# EAGLE design vertical_driver (EAGLE 8.5.2)
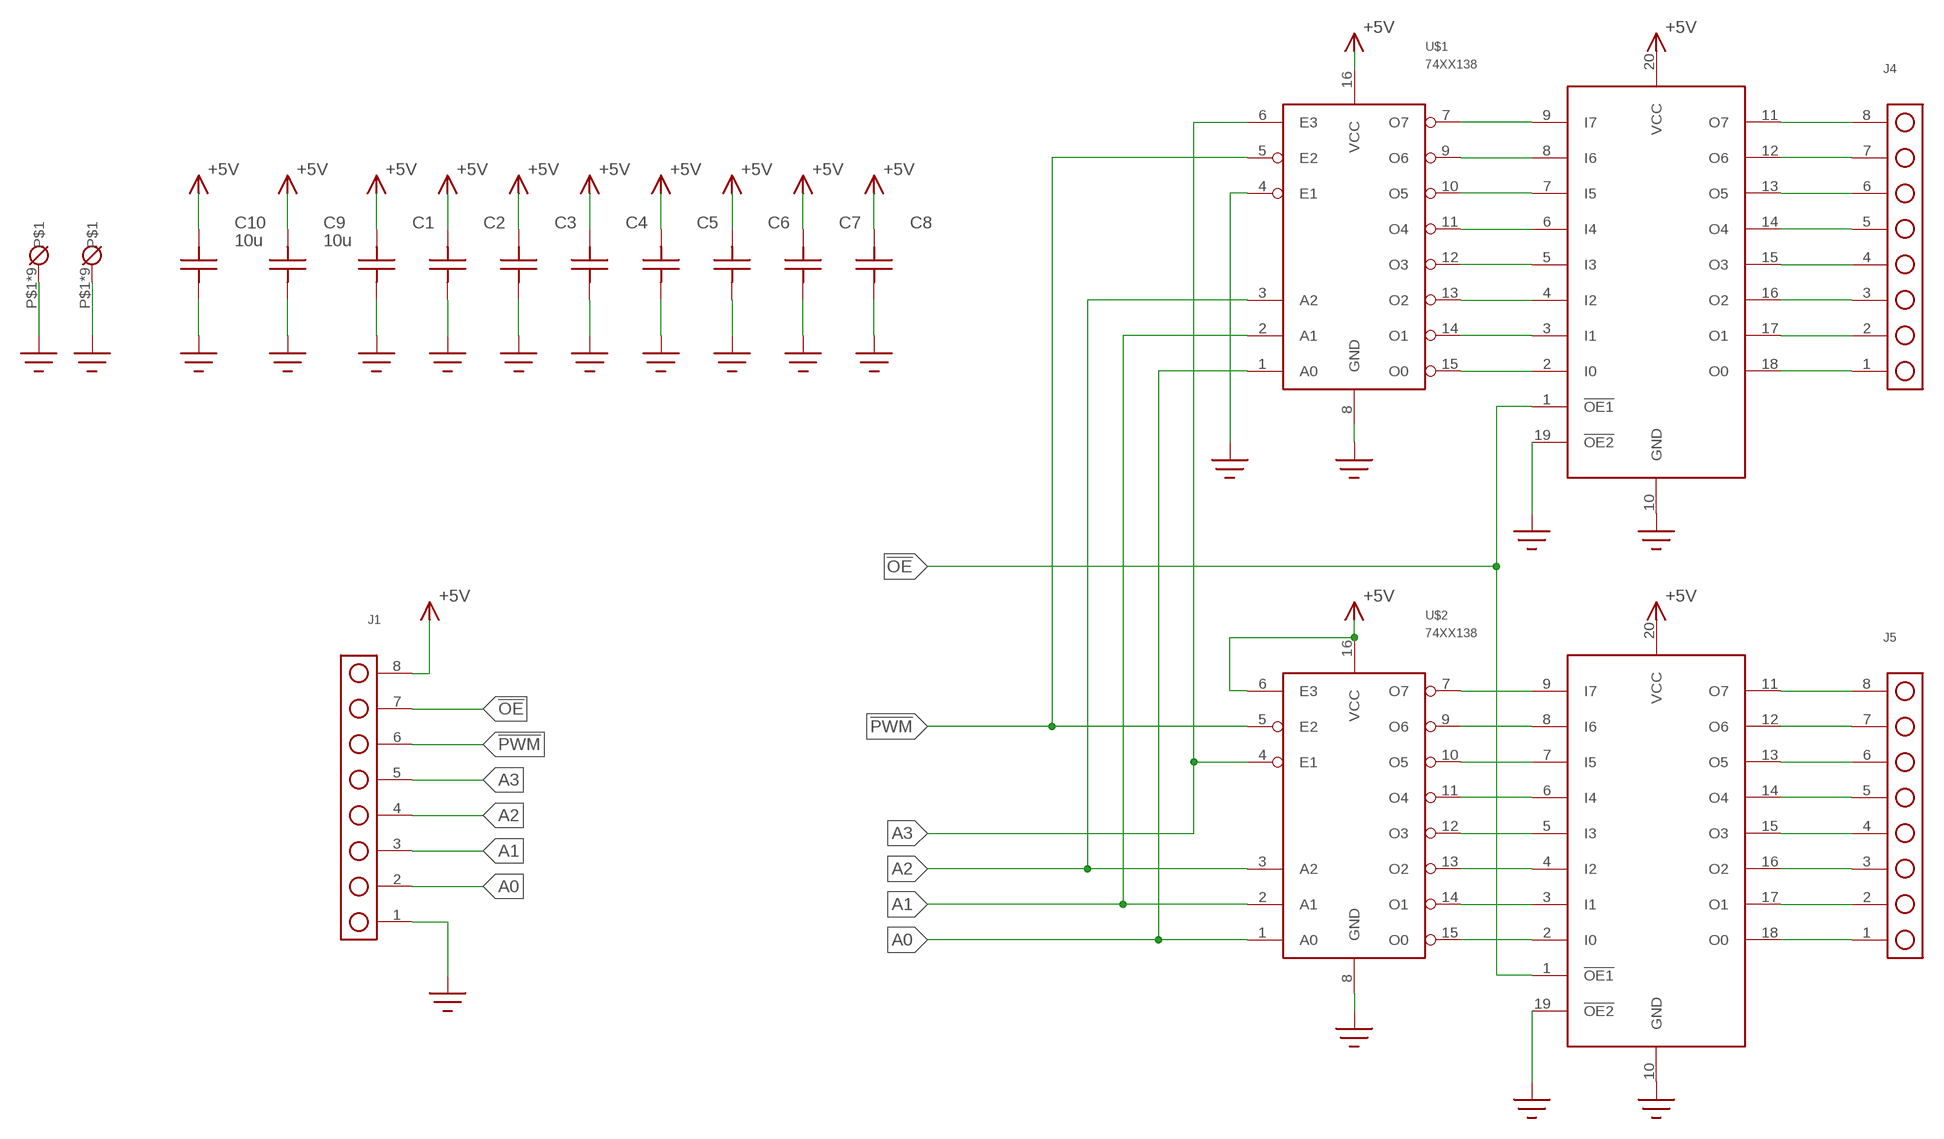
[diagram p0: schematic, sheet 1]

## Parts
C1  C0805  [0805]
C2  C0805  [0805]
C3  C0805  [0805]
C4  C0805  [0805]
C5  C0805  [0805]
C6  C0805  [0805]
C7  C0805  [0805]
C8  C0805  [0805]
C9  10u  C1206  [1206]
C10  10u  C1206  [1206]
J1  HEADER_8P  [HEADER_8P]
J4  HEADER_8P  [HEADER_8P]
J5  HEADER_8P  [HEADER_8P]
U$1  74XX138  [SOIC-16]
U$2  74XX138  [SOIC-16]
U$8  74XX540  [SOIC-20W]
U$9  74XX540  [SOIC-20W]
U$34  MOUNTING_HOLE  [MOUNTING_HOLE_#4]
U$35  MOUNTING_HOLE  [MOUNTING_HOLE_#4]

## Nets
!OE!: J1.7 U$8.1(!OE1!) U$9.1(!OE1!)
!PWM!: J1.6 U$1.5(E2) U$2.5(E2)
+5V: C1.P$2 C2.P$2 C3.P$2 C4.P$2 C5.P$2 C6.P$2 C7.P$2 C8.P$2 C9.P$2 C10.P$2 J1.8 U$1.16(VCC) U$2.6(E3) U$2.16(VCC) U$8.20(VCC) U$9.20(VCC)
A0: J1.2 U$1.1(A0) U$2.1(A0)
A1: J1.3 U$1.2(A1) U$2.2(A1)
A2: J1.4 U$1.3(A2) U$2.3(A2)
A3: J1.5 U$1.6(E3) U$2.4(E1)
GND: C1.P$1 C2.P$1 C3.P$1 C4.P$1 C5.P$1 C6.P$1 C7.P$1 C8.P$1 C9.P$1 C10.P$1 J1.1 U$1.4(E1) U$1.8(GND) U$2.8(GND) U$8.10(GND) U$8.19(!OE2!) U$9.10(GND) U$9.19(!OE2!) U$34.P$1 U$34.P$2 U$34.P$3 U$34.P$4 U$34.P$5 U$34.P$6 U$34.P$7 U$34.P$8 U$34.P$9 U$35.P$1 U$35.P$2 U$35.P$3 U$35.P$4 U$35.P$5 U$35.P$6 U$35.P$7 U$35.P$8 U$35.P$9
N$1: U$1.7(O7) U$8.9(I7)
N$2: U$1.9(O6) U$8.8(I6)
N$3: U$1.10(O5) U$8.7(I5)
N$4: U$1.11(O4) U$8.6(I4)
N$5: U$1.12(O3) U$8.5(I3)
N$6: U$1.13(O2) U$8.4(I2)
N$7: U$1.14(O1) U$8.3(I1)
N$8: U$1.15(O0) U$8.2(I0)
N$9: J4.8 U$8.11(O7)
N$10: J4.7 U$8.12(O6)
N$11: J4.6 U$8.13(O5)
N$12: J4.5 U$8.14(O4)
N$13: J4.4 U$8.15(O3)
N$14: J4.3 U$8.16(O2)
N$15: J4.2 U$8.17(O1)
N$16: J4.1 U$8.18(O0)
N$17: U$2.7(O7) U$9.9(I7)
N$18: U$2.9(O6) U$9.8(I6)
N$19: U$2.10(O5) U$9.7(I5)
N$20: U$2.11(O4) U$9.6(I4)
N$21: U$2.12(O3) U$9.5(I3)
N$22: U$2.13(O2) U$9.4(I2)
N$23: U$2.14(O1) U$9.3(I1)
N$24: U$2.15(O0) U$9.2(I0)
N$25: J5.8 U$9.11(O7)
N$26: J5.7 U$9.12(O6)
N$27: J5.6 U$9.13(O5)
N$28: J5.5 U$9.14(O4)
N$29: J5.4 U$9.15(O3)
N$30: J5.3 U$9.16(O2)
N$31: J5.2 U$9.17(O1)
N$32: J5.1 U$9.18(O0)

## Library data of the parts
C1-C10 = led_oscilloscope:C
J1 J4 J5 = led_oscilloscope:HEADER_8P
U$1 U$2 = led_oscilloscope:74XX138
U$8 U$9 = led_oscilloscope:74XX540
U$34 U$35 = led_oscilloscope:MOUNTING_HOLE

## Board
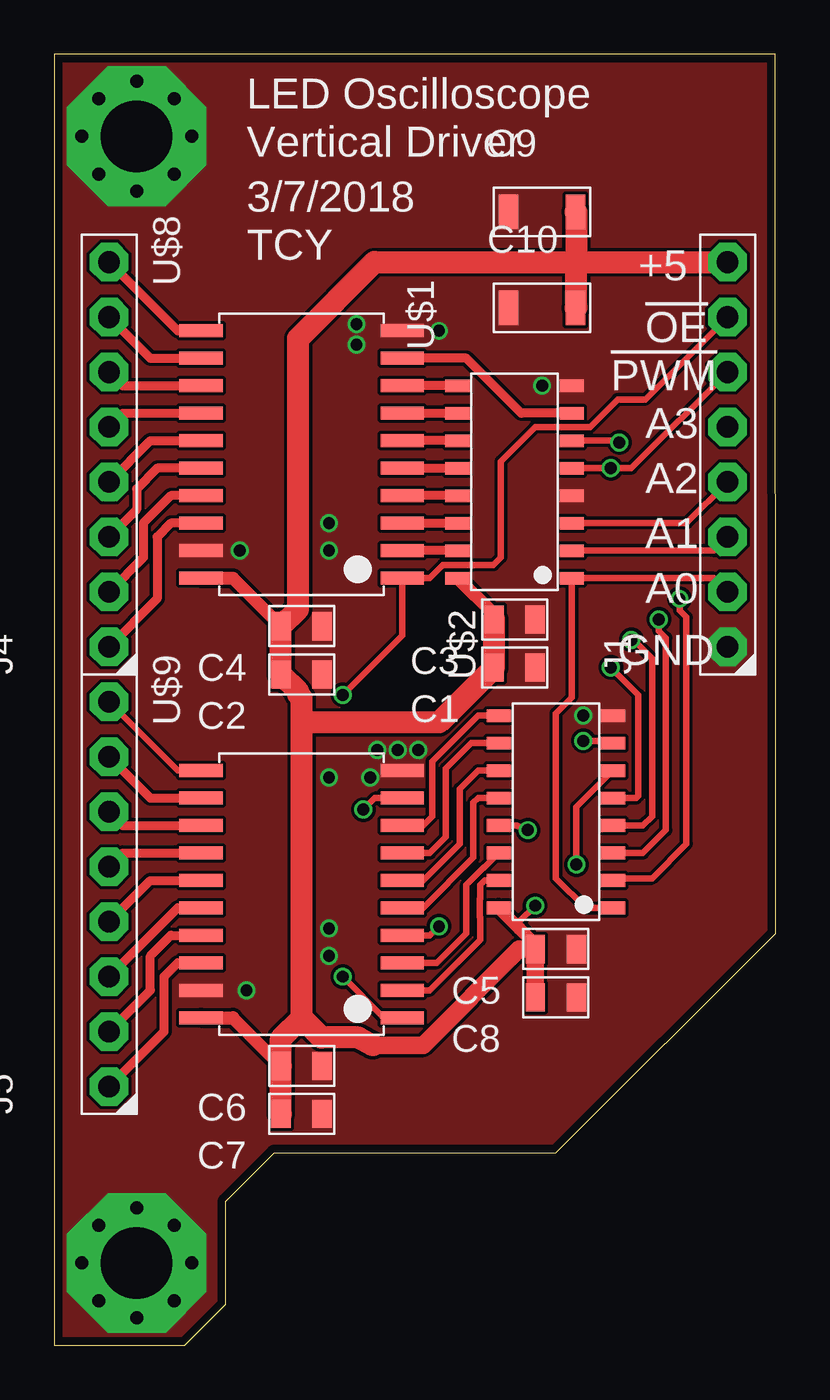
[diagram p1: board, top side]
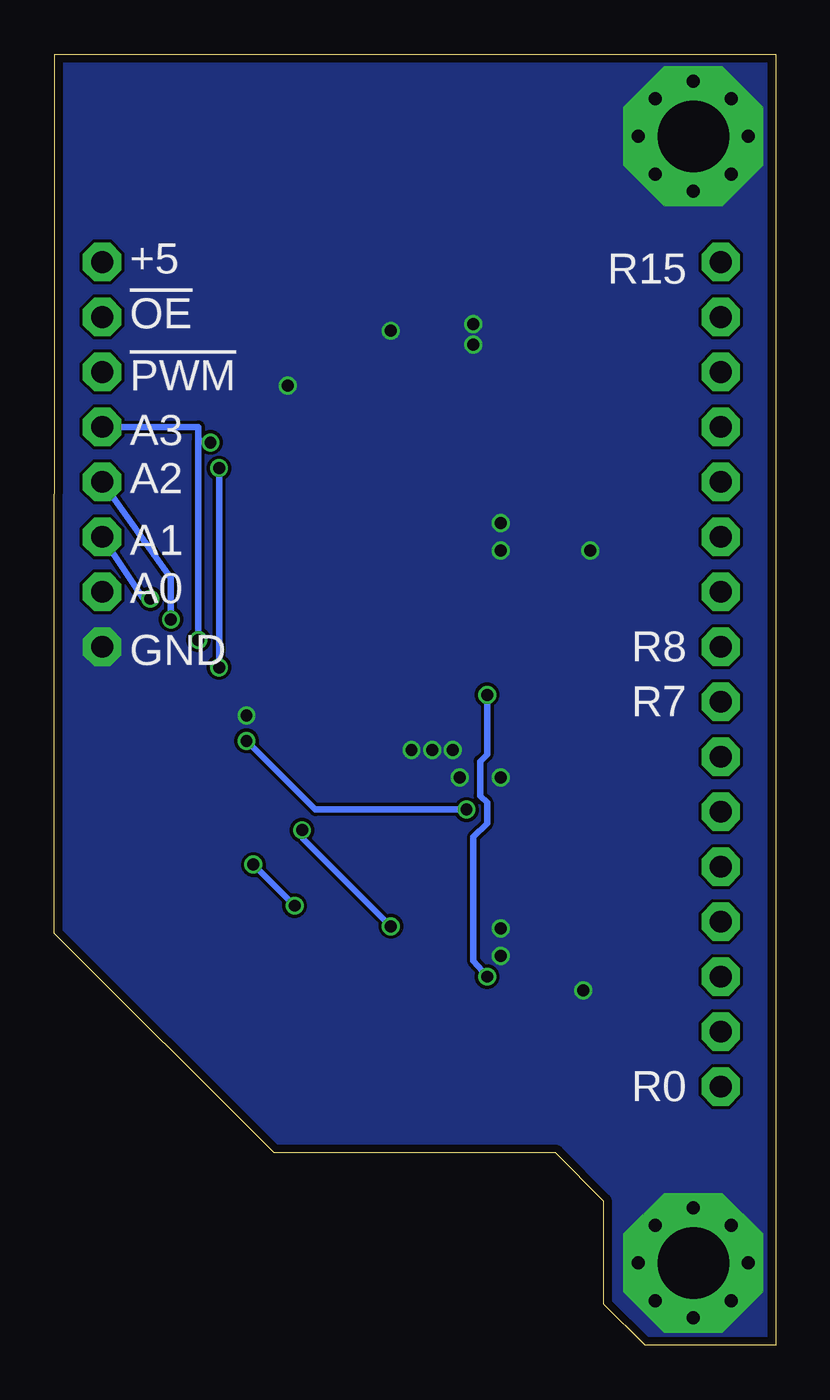
[diagram p2: board, bottom side, seen from below]

Size 33.34 x 59.68 mm. Coordinates in mm from the lower left corner, seen from the top.
Outline: 0,0 6.03,0 7.94,1.91 7.94,6.67 10.16,8.89 23.18,8.89 33.34,19.05 33.32,59.68 0,59.68 0,0
Copper layers (1*16): Top 0.035559375mm / dielectric 1.6mm / Bottom 0.035559375mm
Design rules "oshpark-2layer": minimum track width 6mil, minimum drill 10mil, track to track 6mil, track to pad 6mil, pad to pad 6mil, via to via 6mil, smd to smd 6mil, copper to edge 15mil, drill to drill 6mil, minimum pad ring 5mil, minimum via ring 5mil, stop-mask expansion 2.5mil, vias tented up to drill 0mil, thermal gap 10mil

### Footprints (pad centres in the part's own frame; a part is rotated, then mirrored left to right if it is on the bottom)
0805 = smd 0.9 x 1.3: P$1 -0.95,0; P$2 0.95,0
1206 = smd 0.9 x 1.6: P$1 -1.55,0; P$2 1.55,0
HEADER_8P = drill 1 pad 1.778 octagon: 1 -8.89,0; 2 -6.35,0; 3 -3.81,0; 4 -1.27,0; 5 1.27,0; 6 3.81,0; 7 6.35,0; 8 8.89,0
SOIC-16 = smd 0.58 x 1.12: 1 -4.445,-2.64; 2 -3.175,-2.64; 3 -1.905,-2.64; 4 -0.635,-2.64; 5 0.635,-2.64; 6 1.905,-2.64; 7 3.175,-2.64; 8 4.445,-2.64; 9 4.445,2.64; 10 3.175,2.64; 11 1.905,2.64; 12 0.635,2.64; 13 -0.635,2.64; 14 -1.905,2.64; 15 -3.175,2.64; 16 -4.445,2.64
SOIC-20W = smd 0.6 x 2: 1 -5.715,-4.65; 2 -4.445,-4.65; 3 -3.175,-4.65; 4 -1.905,-4.65; 5 -0.635,-4.65; 6 0.635,-4.65; 7 1.905,-4.65; 8 3.175,-4.65; 9 4.445,-4.65; 10 5.715,-4.65; 11 5.715,4.65; 12 4.445,4.65; 13 3.175,4.65; 14 1.905,4.65; 15 0.635,4.65; 16 -0.635,4.65; 17 -1.905,4.65; 18 -3.175,4.65; 19 -4.445,4.65; 20 -5.715,4.65
MOUNTING_HOLE_#4 = drill 3.302 pad 6.452 octagon: P$1 0,0 | drill 0.6 pad 0.813 octagon: P$2 0,2.54; P$3 -2.54,0; P$4 2.54,0; P$5 0,-2.54; P$6 -1.746,1.746; P$7 1.746,1.746; P$8 -1.746,-1.746; P$9 1.746,-1.746

### Placement (x,y rotation side)
C1  21.27,31.33 180 top
C2  11.43,31.01 180 top
C3  21.27,33.55 180 top
C4  11.43,33.24 180 top
C5  23.18,18.31 180 top
C6  11.43,12.92 180 top
C7  11.43,10.69 180 top
C8  23.18,16.09 180 top
C9  22.54,52.39 0 top
C10  22.54,47.94 0 top
J1  31.11,41.17 90 top
J4  2.54,41.17 90 top
J5  2.54,20.85 90 top
U$1  21.27,39.9 90 top
U$2  23.18,24.66 90 top
U$8  11.43,41.17 90 top
U$9  11.43,20.85 90 top
U$34  3.81,3.81 0 top
U$35  3.81,55.88 0 top

### Tracks (layer width: path | path; a pad name or v marks a point on that pad's centre or on a via)
!OE!  (via drill 0.55)
  Top 0.305: J1.7 27.3,43.71 26.04,43.71 24.77,42.44 22.23,42.44 20.64,40.86 20.64,36.41 20.3,36.07 17.96,36.07 17.35,35.46 U$8.1 16.08,32.81 v13.34,30.06 | v13.34,17.04 15.24,15.14 U$9.1
  Bottom 0.305: v13.34,30.06 13.34,27.3 13.65,26.99 13.65,25.4 13.34,25.08 13.34,24.13 13.97,23.5 13.97,17.78 v13.34,17.04
!PWM!  (via drill 0.55)
  Top 0.305: U$1.5 v25.72,40.54 26.67,40.54 J1.6 | U$2.5 26.89,25.3 26.99,25.4 26.99,30.06 v25.72,31.33
  Bottom 0.305: v25.72,31.33 v25.72,40.54
+5V  (via drill 0.55)
  Top 0.305: U$2.6 25.14,25.89 25.13,25.89 24.13,24.89 v24.13,22.23 | v22.23,20.32 21.49,19.58 21.49,19.27
  Top 0.61: U$8.20 8.26,35.46 C4.P$2 | U$9.20 8.26,15.14 C6.P$2 | U$1.16 20.32,33.77 C3.P$2 | U$2.16 21.49,19.27 22.23,18.53 C5.P$2
  Top 0.813: C8.P$2 C5.P$2 21.49,18.31 17.04,13.87 14.73,13.87
  Top 1.016: C7.P$2 C6.P$2 10.48,14.19 11.43,15.14 | C3.P$2 C1.P$2 17.78,28.79 11.43,28.79 | 24.13,50.06 14.8,50.06 11.27,46.53 11.27,34.03 C4.P$2 C2.P$2 11.27,30.22 11.27,30.09 11.43,29.93 11.43,28.79 | 24.13,50.06 J1.8 | 11.43,15.14 11.43,28.79 | 11.43,15.14 12.34,14.23 14.06,14.23 14.73,13.87 | C9.P$2 24.13,52.35 24.13,50.06 | C10.P$2 24.13,47.98 24.13,50.06
  Bottom 0.305: v24.13,22.23 v22.23,20.32
A0
  Top 0.305: J1.2 30.48,35.46 U$1.1 23.91,29.95 23.18,29.21 23.18,21.59 24.55,20.22 U$2.1
A1  (via drill 0.55)
  Top 0.305: J1.3 30.48,36.73 U$1.2 | U$2.2 25.92,21.59 27.62,21.59 29.21,23.18 29.21,33.66 28.89,33.97 v28.89,34.51
  Bottom 0.305: v28.89,34.51 29.21,34.51 J1.3
A2  (via drill 0.55)
  Top 0.305: J1.4 29.21,38 U$1.3 | U$2.3 27.2,22.76 28.26,23.81 28.26,32.7 27.94,33.02 v27.94,33.55
  Bottom 0.305: v27.94,33.55 27.94,35.46 J1.4
A3  (via drill 0.55)
  Top 0.305: v26.11,41.73 25.72,41.81 U$1.6 | U$2.4 27.2,24.03 27.62,24.45 27.62,31.75 26.77,32.6 v26.67,32.6
  Bottom 0.305: v26.67,32.6 26.67,41.81 | 26.67,41.81 v26.11,41.73 | J1.5 26.67,42.44 26.67,41.81
GND  (via drill 0.55)
  other vias: 8.57,36.73 13.97,47.21 17.78,46.89 13.97,46.25 16.83,27.52 15.88,27.52 8.89,16.41 12.7,38 12.7,36.73 12.7,18 12.7,19.27 12.7,26.25 14.61,26.25 24.45,29.11 22.54,44.35 14.92,27.52
  pour Top (no thermals): 0,0 33.34,0 33.34,59.69 0,59.69
  pour Bottom (no thermals): 0,0 33.34,0 33.34,59.69 0,59.69
N$1
  Top 0.305: U$8.9 16.83,45.62
  Top 0.406: U$1.7 21.59,43.08 19.05,45.62 16.83,45.62
N$2
  Top 0.406: U$1.9 U$8.8
N$3
  Top 0.406: U$8.7 U$1.10
N$4
  Top 0.406: U$1.11 U$8.6
N$5
  Top 0.406: U$8.5 U$1.12
N$6
  Top 0.406: U$1.13 U$8.4
N$7
  Top 0.406: U$8.3 U$1.14
N$8
  Top 0.406: U$1.15 U$8.2
N$9
  Top 0.406: J4.8 5.71,46.89 U$8.11
N$10
  Top 0.406: J4.7 4.45,45.62 U$8.12
N$11
  Top 0.406: J4.6 3.17,44.35 U$8.13
N$12
  Top 0.406: J4.5 3.17,43.08 U$8.14
N$13
  Top 0.406: J4.4 4.45,41.81 U$8.15
N$14
  Top 0.406: U$8.16 4.76,40.54 3.81,39.59 3.81,38.63 J4.3
N$15
  Top 0.406: U$8.17 5.4,39.27 4.13,38 4.13,36.41 J4.2
N$16
  Top 0.406: U$8.18 5.4,38 4.76,37.36 4.76,34.51 J4.1
N$17  (via drill 0.55)
  Top 0.305: U$9.9 14.82,25.3 v14.29,24.77 | v24.45,27.94 25.72,27.94 U$2.7
  Bottom 0.305: v14.29,24.77 21.27,24.77 v24.45,27.94
N$18
  Top 0.305: U$9.8 17.04,24.03 17.46,24.45 17.46,26.99 19.58,29.11 U$2.9
N$19
  Top 0.305: U$9.7 17.36,22.76 18.1,23.5 18.1,26.67 19.27,27.84 U$2.10
N$20
  Top 0.305: U$9.6 17.04,21.49 18.73,23.18 18.73,25.72 19.58,26.57 U$2.11
N$21
  Top 0.305: U$9.5 17.04,20.22 19.37,22.54 19.37,25.08 19.58,25.3 U$2.12
N$22  (via drill 0.55)
  Top 0.305: U$9.4 17.36,18.95 v17.78,19.37 | v21.88,23.81 21.35,24.03 U$2.13
  Bottom 0.305: v17.78,19.37 21.82,23.41 21.82,23.81 v21.88,23.81
N$23
  Top 0.305: U$9.3 17.68,17.68 19.05,19.05 19.05,21.28 19.85,22.08 19.86,22.08 U$2.14
N$24
  Top 0.305: U$9.2 17.36,16.41 19.68,18.73 19.68,19.79 19.67,19.8 19.67,20.64 19.68,20.65 19.68,21.27 19.9,21.49 U$2.15
N$25
  Top 0.305: J5.8 5.71,26.57 U$9.11
N$26
  Top 0.406: J5.7 4.45,25.3 U$9.12
N$27
  Top 0.406: J5.6 3.17,24.03 U$9.13
N$28
  Top 0.406: J5.5 3.17,22.76 U$9.14
N$29
  Top 0.406: J5.4 4.45,21.49 U$9.15
N$30
  Top 0.406: J5.3 5.71,20.22 U$9.16
N$31
  Top 0.406: J5.2 4.45,16.41 4.45,18 5.4,18.95 U$9.17
N$32
  Top 0.406: J5.1 5.08,14.5 5.08,17.04 5.71,17.68 U$9.18

### Text on the board
tPlace: LED Oscilloscope | Vertical Driver | 3/7/2018 | TCY | +5 | !OE! | !PWM! | A3 | A2 | A1 | A0 | GND
bPlace: R15 | +5 | !OE! | !PWM! | A3 | A2 | A1 | A0 | R8 | GND | R7 | R0